# Altium project INCUBA 1.3.PrjPcb
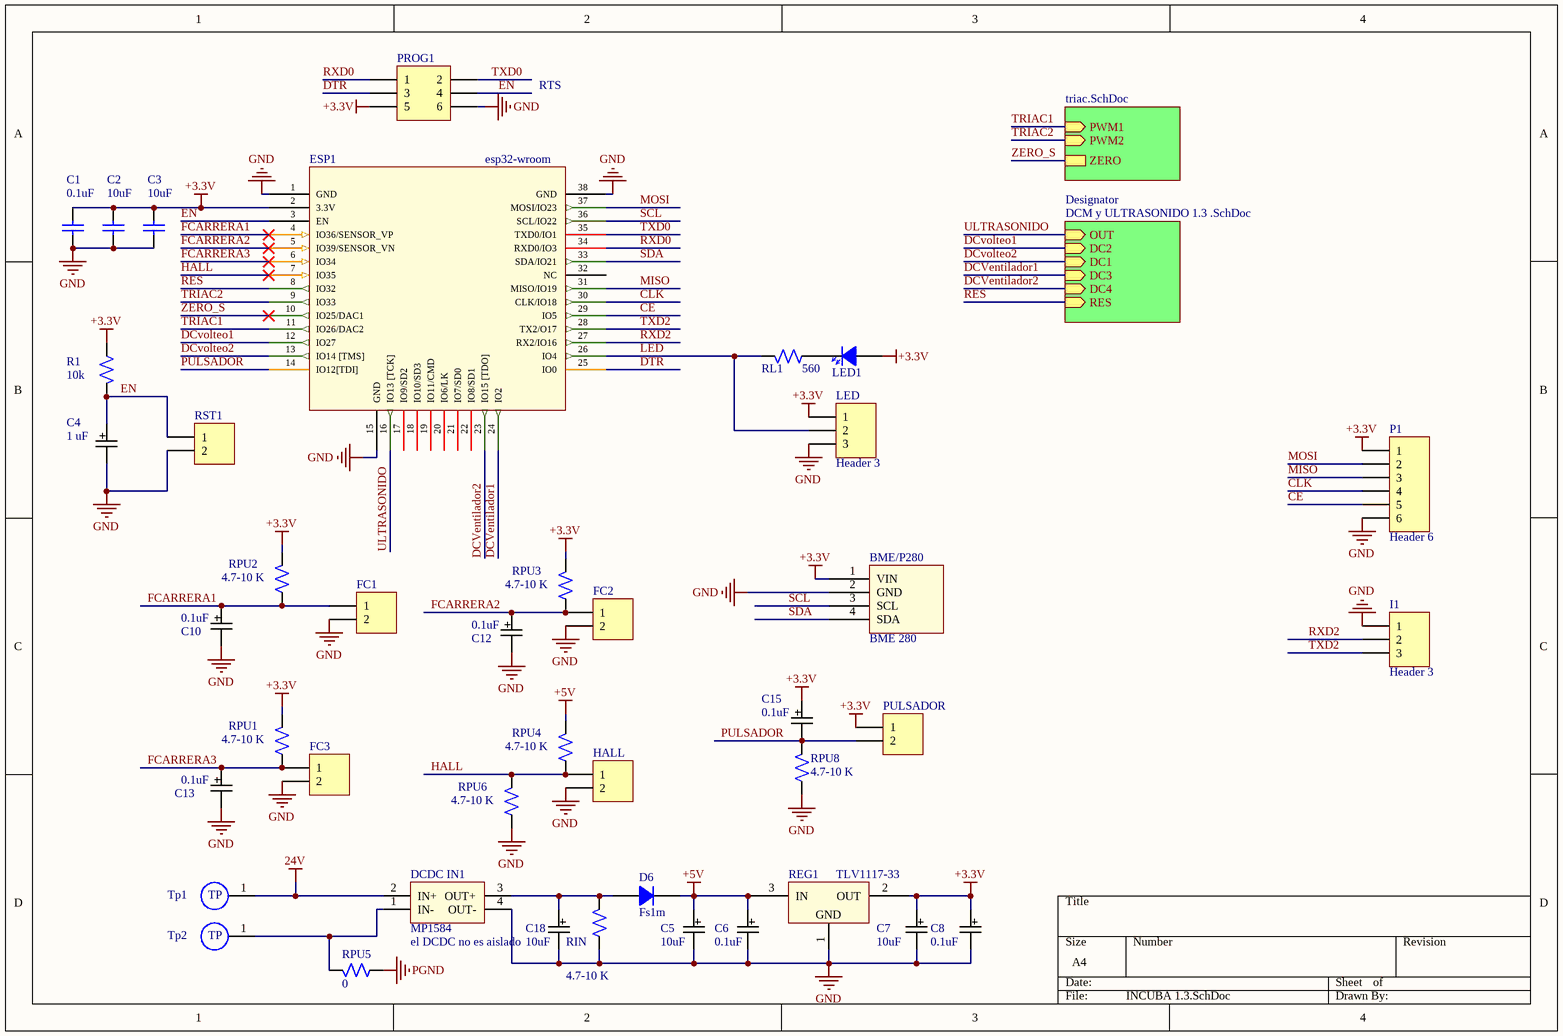
[diagram p0: INCUBA 1.3.SchDoc]
3 sheets, 83 parts. Net scope: hierarchical (ports join the sheet entries above them; power ports are global).
Board file: INCUBA 1.3.PcbDoc
Sheets:
  INCUBA 1.3.SchDoc
    Designator = triac.SchDoc
    Designator = DCM y ULTRASONIDO 1.3 .SchDoc

## Sheet INCUBA 1.3.SchDoc
size A4; SheetNumber: 1; SheetTotal: 3

### Parts
BME/P280  BME 280  [bme280]
C1  value 0.1uF  [0805]
C2  value 10uF  [0805]
C3  value 10uF  [0805]
C4  value 1 uF  [0805]  (hidden comment: Capacitor)
C5  value 10uF  [0805]  (hidden comment: Capacitor)
C6  value 0.1uF  [0805]  (hidden comment: Capacitor)
C7  value 10uF  [0805]  (hidden comment: Capacitor)
C8  0.1uF  [0805]
C10  value 0.1uF  [0805]  (hidden comment: Capacitor)
C12  value 0.1uF  [0805]  (hidden comment: Capacitor)
C13  value 0.1uF  [0805]  (hidden comment: Capacitor)
C15  value 0.1uF  [0805]  (hidden comment: Capacitor)
C18  value 10uF  [0805]  (hidden comment: Capacitor)
D6  Fs1m  [DO-214AC]
DCDC_IN1  MP1584  [MP1584]
ESP1  esp32-wroom  [esp32-wroom - modificado - sinpad]
FC1  Header 2  [HDR1X2]  (value not drawn)
FC2  Header 2  [HDR1X2]  (value not drawn)
FC3  Header 2  [HDR1X2]  (value not drawn)
HALL  Header 2  [HDR1X2]  (value not drawn)
I1  Header 3  [HDR1X3]
LED  Header 3  [HDR1X3]
LED1  LED_SMD  [0805 - led]  (value not drawn)
P1  Header 6  [HDR1X6]
PROG1  Header 3X2  [HDR2X3]  (value not drawn)
PULSADOR  Header 2  [HDR1X2]  (value not drawn)
R1  value 10k  [0805]  (hidden comment: Resistencia)
REG1  TLV1117-33  [SOT-223-4]
RIN  value 4.7-10 K  [0805]  (hidden comment: Resistencia)
RL1  value 560  [0805]  (hidden comment: Resistencia)
RPU1  value 4.7-10 K  [0805]  (hidden comment: Resistencia)
RPU2  value 4.7-10 K  [0805]  (hidden comment: Resistencia)
RPU3  value 4.7-10 K  [0805]  (hidden comment: Resistencia)
RPU4  value 4.7-10 K  [0805]  (hidden comment: Resistencia)
RPU5  value 0  [0805]  (hidden comment: Resistencia)
RPU6  value 4.7-10 K  [0805]  (hidden comment: Resistencia)
RPU8  value 4.7-10 K  [0805]  (hidden comment: Resistencia)
RST1  Header 2  [HDR1X2]  (value not drawn)
Tp1  Testpoint  [Testpoint]  (value not drawn)
Tp2  Testpoint  [Testpoint]  (value not drawn)

### Sub-sheets
Designator = triac.SchDoc: PWM1 (in), PWM2 (in), ZERO
Designator = DCM y ULTRASONIDO 1.3 .SchDoc: OUT (in), DC2 (in), DC1 (in), DC3 (in), DC4 (in), RES (in)

### Nets
24V: DCDC_IN1.2(IN+) Tp1.1(TP)
+3.3V: BME/P280.1(VIN) C1.2 C2.2 C3.2 C7.2 C8.2 C15.2 ESP1.2(3.3V) LED.1 LED1.2(A) P1.1 PROG1.5 PULSADOR.1 R1.2 REG1.2(OUT) RPU1.2 RPU2.2 RPU3.2
+5V: C5.2 C6.2 D6.1(K) REG1.3(IN) RPU4.2
GND: BME/P280.2(GND) C1.1 C2.1 C3.1 C4.1 C5.1 C6.1 C7.1 C8.1 C10.1 C12.1 C13.1 C18.1 DCDC_IN1.4(OUT-) ESP1.1(GND) ESP1.15(GND) ESP1.38(GND) FC1.2 FC2.2 FC3.2 HALL.2 I1.1 LED.3 P1.6 PROG1.6 REG1.1(GND) RIN.1 RPU6.1 RPU8.1 RST1.2
PGND: RPU5.1
CE: ESP1.29(IO5) P1.5
CLK: ESP1.30(CLK/IO18) P1.4
DCVentilador1: ESP1.24(IO2) ; sheet Designator/DC3
DCVentilador2: ESP1.23(IO15_[TDO]) ; sheet Designator/DC4
DCvolteo1: ESP1.12(IO27) ; sheet Designator/DC2
DCvolteo2: ESP1.13(IO14_[TMS]) ; sheet Designator/DC1
DTR: ESP1.25(IO0) PROG1.3
EN: C4.2 ESP1.3(EN) PROG1.4 R1.1 RST1.1
FCARRERA1: C10.2 ESP1.4(IO36/SENSOR_VP) FC1.1 RPU2.1
FCARRERA2: C12.2 ESP1.5(IO39/SENSOR_VN) FC2.1 RPU3.1
FCARRERA3: C13.2 ESP1.6(IO34) FC3.1 RPU1.1
HALL: ESP1.7(IO35) HALL.1 RPU4.1 RPU6.2
LED: ESP1.26(IO4) LED.2 RL1.2
MISO: ESP1.31(MISO/IO19) P1.3
MOSI: ESP1.37(MOSI/IO23) P1.2
PULSADOR: C15.1 ESP1.14(IO12[TDI]) PULSADOR.2 RPU8.2
RES: ESP1.8(IO32) ; sheet Designator/RES
RXD0: ESP1.34(RXD0/IO3) PROG1.1
RXD2: ESP1.27(RX2/IO16) I1.2
SCL: BME/P280.3(SCL) ESP1.36(SCL/IO22)
SDA: BME/P280.4(SDA) ESP1.33(SDA/IO21)
TRIAC1: ESP1.11(IO26/DAC2) ; sheet Designator/PWM1
TRIAC2: ESP1.9(IO33) ; sheet Designator/PWM2
TXD0: ESP1.35(TXD0/IO1) PROG1.2
TXD2: ESP1.28(TX2/O17) I1.3
ULTRASONIDO: ESP1.16(IO13_[TCK]) ; sheet Designator/OUT
ZERO_S: ESP1.10(IO25/DAC1) ; sheet Designator/ZERO
NetC18_2: C18.2 D6.2(A) DCDC_IN1.3(OUT+) RIN.2
NetDCDC_IN1_1: DCDC_IN1.1(IN-) RPU5.2 Tp2.1(TP)
NetLED1_1: LED1.1(K) RL1.1

Not connected (* = marked no-connect by the designer): ESP1 17(IO9/SD2) 18(IO10/SD3) 19(IO11/CMD) 20(IO6/LK) 21(IO7/SD0) 22(IO8/SD1) 32(NC)

### Notes on the sheet
- RTS
- el DCDC no es aislado

### Library data of the parts
C1-C3 = Cap SMD: Capacitor; Published: 8-Jun-2000; LatestRevisionDate: 29-May-2009; LatestRevisionNote: IPC-7351 Footprint Added.; PackageReference: C0805; Publisher: Altium Limited; PackageDescription: Chip Capacitor
C7 = Capacitor: 100UFX6.3V 10%. B=3528 (1210) TAN.SMD AVX Codigo Elemon CA3388050
C8 = Capacitor
D6 = Diodo: DSK14 , US1M. Fs1m; Published: 8-Jun-2000; LatestRevisionDate: 17-Jul-2002; LatestRevisionNote: Re-released for DXP Platform.; PackageDocument: Sep-1996; PackageReference: SMC; Publisher: Altium Limited; Code_JEDEC: DO-214-AB
FC1-FC3 HALL PULSADOR RST1 = Header 2: Header, 2-Pin; LatestRevisionDate: 17-Jul-2002; LatestRevisionNote: Re-released for DXP Platform.; Publisher: Altium Limited
I1 LED = Header 3: Header, 3-Pin; LatestRevisionDate: 17-Jul-2002; LatestRevisionNote: Re-released for DXP Platform.; Publisher: Altium Limited
LED1 = LED_SMD: Luminic signal diode; Published: 8-Jun-2000; LatestRevisionDate: 17-Jul-2002; LatestRevisionNote: Re-released for DXP Platform.; PackageDocument: Sep-1996; PackageReference: SMC; Publisher: Altium Limited; Code_JEDEC: DO-214-AB
P1 = Header 6: Header, 6-Pin; LatestRevisionDate: 17-Jul-2002; LatestRevisionNote: Re-released for DXP Platform.; Publisher: Altium Limited
PROG1 = Header 3X2: Header, 3-Pin, Dual row; System: Connector; LatestRevisionDate: 17-Jul-2002; LatestRevisionNote: Re-released for DXP Platform.; Publisher: Altium Limited
R1 RIN RL1 RPU1-RPU6 RPU8 = Resistencia: Resistencia  de con varios Footprint
Tp1 Tp2 = Testpoint: Tespoint

## Sheet triac.SchDoc
size A4; SheetNumber: 2; SheetTotal: 3
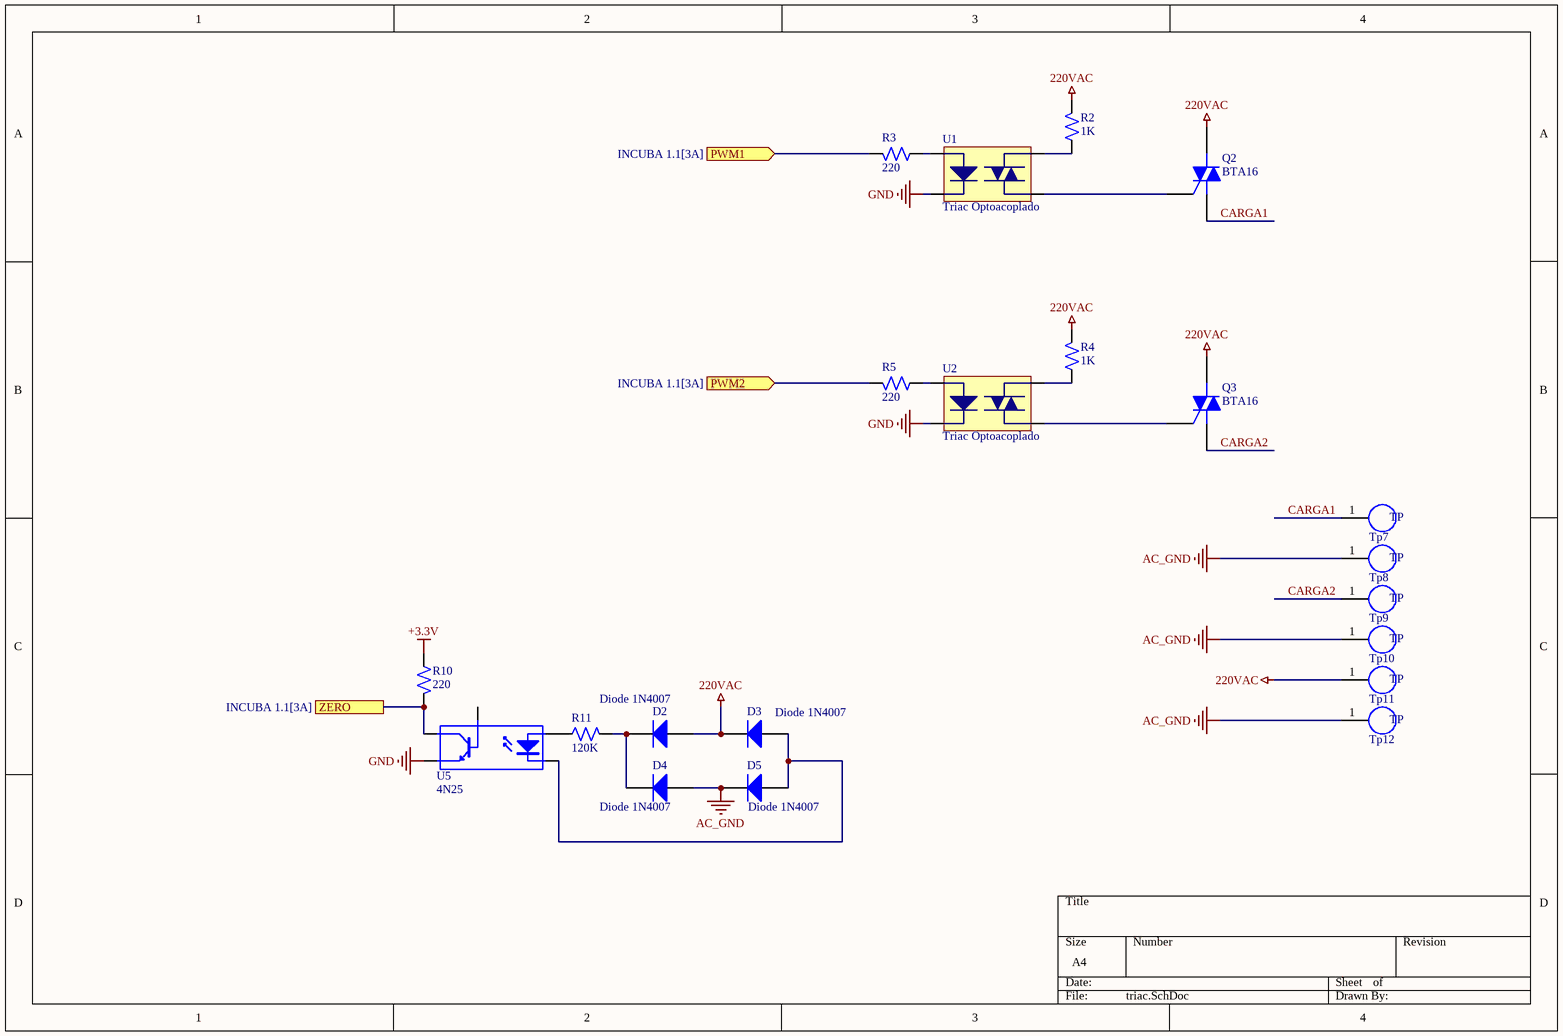
[diagram p1: triac.SchDoc]

### Parts
D2  Diode 1N4007  [DO-214AC]
D3  Diode 1N4007  [DO-214AC]
D4  Diode 1N4007  [DO-214AC]
D5  Diode 1N4007  [DO-214AC]
Q2  BTA16  [TO-220]
Q3  BTA16  [TO-220]
R2  value 1K  [0805]  (hidden comment: Resistencia)
R3  value 220  [0805]  (hidden comment: Resistencia)
R4  value 1K  [0805]  (hidden comment: Resistencia)
R5  value 220  [0805]  (hidden comment: Resistencia)
R10  value 220  [0805]  (hidden comment: Resistencia)
R11  value 120K  [0805]  (hidden comment: Resistencia)
Tp7  Testpoint  [Testpoint]  (value not drawn)
Tp8  Testpoint  [Testpoint]  (value not drawn)
Tp9  Testpoint  [Testpoint]  (value not drawn)
Tp10  Testpoint  [Testpoint]  (value not drawn)
Tp11  Testpoint  [Testpoint]  (value not drawn)
Tp12  Testpoint  [Testpoint]  (value not drawn)
U1  Triac Optoacoplado  [DIP6]
U2  Triac Optoacoplado  [DIP6]
U5  4N25  [DIP6]

### Ports
PWM1 (in, see INCUBA 1.1[3A]), PWM2 (in, see INCUBA 1.1[3A]), ZERO (see INCUBA 1.1[3A])

### Nets
220VAC: D2.1(A) D3.2(K) Q2.2(M2) Q3.2(M2) R2.2 R4.2 Tp11.1(TP)
+3.3V: R10.1
AC_GND: D4.1(A) D5.2(K) Tp8.1(TP) Tp10.1(TP) Tp12.1(TP)
GND: U1.2 U2.2 U5.4(E)
CARGA1: Q2.1(M1) Tp7.1(TP)
CARGA2: Q3.1(M1) Tp9.1(TP)
TRIAC1: R3.2 ; port PWM1
TRIAC2: R5.2 ; port PWM2
ZERO_S: R10.2 U5.5(C) ; port ZERO
NetD2_2: D2.2(K) D4.2(K) R11.2
NetD3_1: D3.1(A) D5.1(A) U5.2(K)
NetQ2_3: Q2.3(G) U1.4
NetQ3_3: Q3.3(G) U2.4
NetR2_1: R2.1 U1.6
NetR3_1: R3.1 U1.1
NetR4_1: R4.1 U2.6
NetR5_1: R5.1 U2.1
NetR11_1: R11.1 U5.1(A)

Not connected (* = marked no-connect by the designer): U5 6(B)

### Library data of the parts
D2-D5 = Diode 1N4007: 1 Amp General Purpose Rectifier; Published: 8-Jun-2000; LatestRevisionDate: 17-Jul-2002; LatestRevisionNote: Re-released for DXP Platform.; DatasheetVersion: 1998; PackageVersion: Aug-1999; PackageReference: DO-41; Publisher: Altium Limited; PackageDescription: Diode, Axial; Body 5.2 x 2.7 mm (LxDia. max), Lead Dia. 0.86 mm (max); Code_JEDEC: DO-204-AL; ComponentLink1Description: Manufacturer Link; ComponentLink1URL: http://www.fairchildsemi.com/; ComponentLink2Description: Datasheet; ComponentLink2URL: http://www.fairchildsemi.com/ds/1N%2F1N4001.pdf
Q2 Q3 = BTA41600B: Triac (40 Amps 600V)
R2-R5 R10 R11 = Resistencia: Resistencia  de con varios Footprint
Tp7-Tp12 = Testpoint: Tespoint
U1 U2 = MOC3040
U5 = 4N25: 5 Pin Mini Flat Pack Optocoupler; Published: 24-Mar-1999; LatestRevisionDate: 04-Mar-2005; LatestRevisionNote: PCB Footprint replaced, Sch pins re-numbered.; DatasheetVersion: Apr-2004; PackageReference: SOP5(6); Publisher: Altium Limited; PackageDescription: Small Outline; 6 Leads (1 Absent); Body Width 4.4 mm; Pitch 1.27 mm

## Sheet DCM y ULTRASONIDO 1.3 .SchDoc
size A4; SheetNumber: 3; SheetTotal: 3
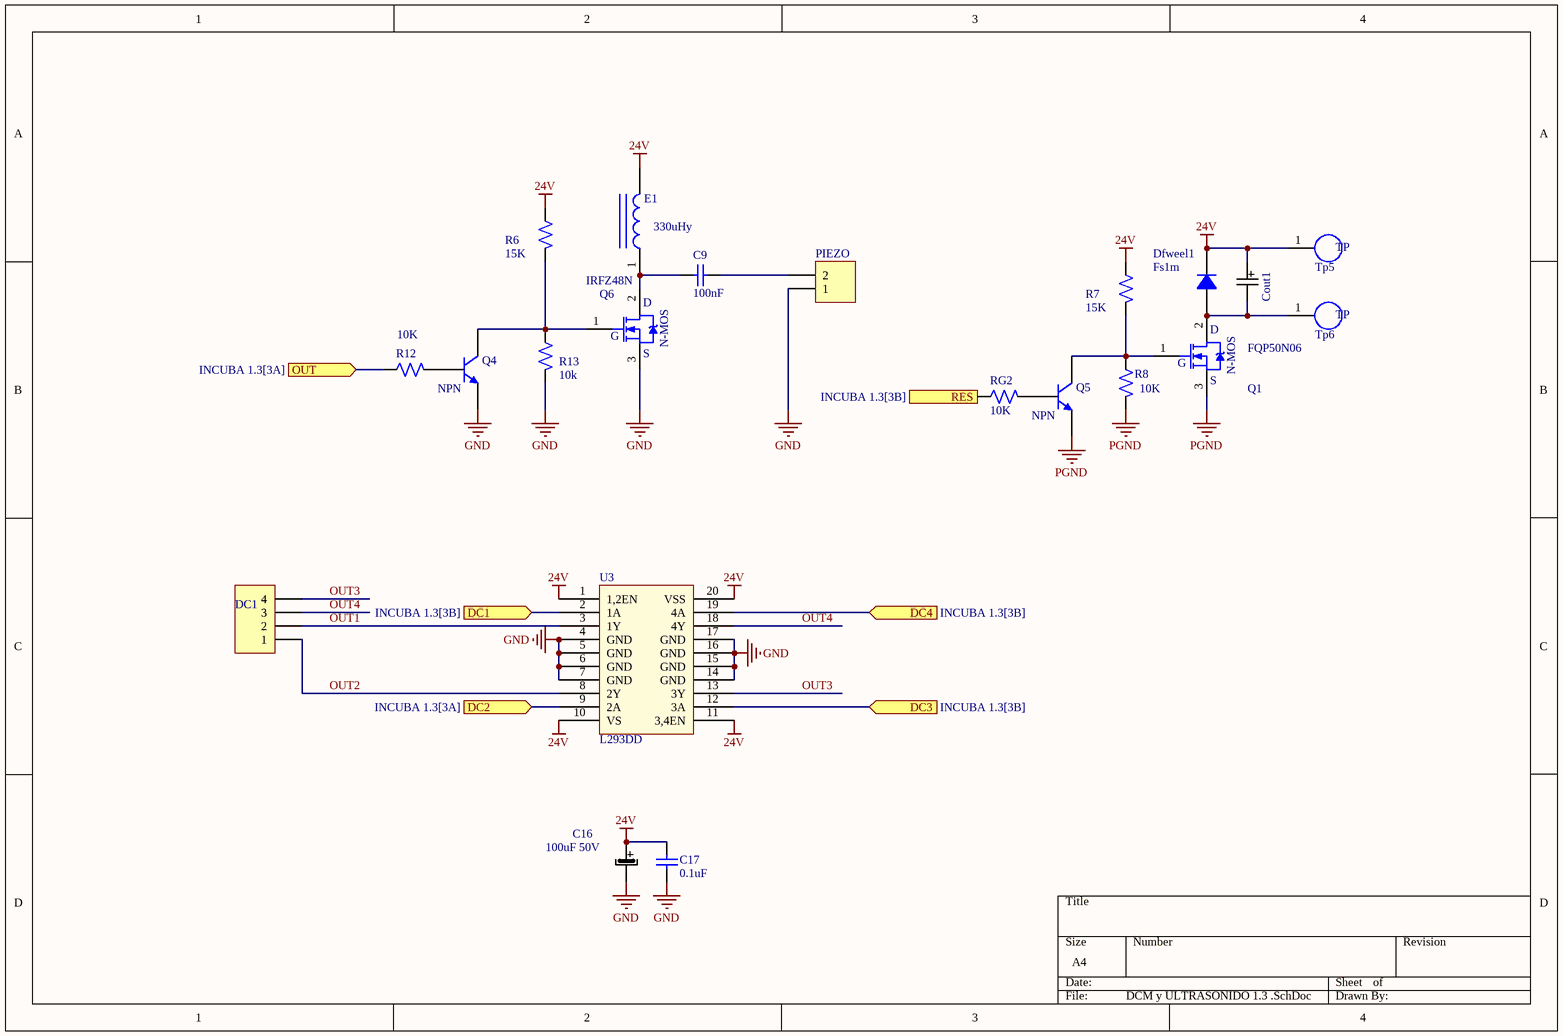
[diagram p2: DCM y ULTRASONIDO 1.3 .SchDoc]

### Parts
C9  value 100nF  [0805]
C16  value 100uF 50V  [cap100]  (hidden comment: Capacitor)
C17  value 0.1uF  [0805]
Cout1  Cout  [0805]  (value not drawn)
DC1  Header 4  [HDR1X4]  (value not drawn)
Dfweel1  Fs1m  [DO-214AC]
E1  value 330uHy  [res200]  (hidden comment: Inductor Iron)
PIEZO  Header 2  [HDR1X2]  (value not drawn)
Q1  FQP50N06  [TO-220]
Q4  NPN  [SOT23-5_hall]
Q5  NPN  [SOT23-5_hall]
Q6  IRFZ48N  [TO-220]
R6  value 15K  [0805]  (hidden comment: Resistencia)
R7  value 15K  [0805]  (hidden comment: Resistencia)
R8  value 10K  [0805]  (hidden comment: Resistencia)
R12  value 10K  [0805]  (hidden comment: Resistencia)
R13  value 10k  [0805]  (hidden comment: Resistencia)
RG2  value 10K  [0805]  (hidden comment: RG)
Tp5  Testpoint  [Testpoint]  (value not drawn)
Tp6  Testpoint  [Testpoint]  (value not drawn)
U3  L293DD  [SOIC127P1032X265-20N]

### Ports
DC1 (in, see INCUBA 1.3[3B]), DC2 (in, see INCUBA 1.3[3A]), DC3 (in, see INCUBA 1.3[3B]), DC4 (in, see INCUBA 1.3[3B]), OUT (in, see INCUBA 1.3[3A]), RES (in, see INCUBA 1.3[3B])

### Nets
24V: C16.2 C17.1 Cout1.2 Dfweel1.1(K) E1.2 R6.2 R7.2 Tp5.1(TP) U3.1(1,2EN) U3.10(VS) U3.11(3,4EN) U3.20(VSS)
GND: C16.1 C17.2 PIEZO.1 Q4.2(E) Q6.3(S) R13.1 U3.4(GND) U3.5(GND) U3.6(GND) U3.7(GND) U3.14(GND) U3.15(GND) U3.16(GND) U3.17(GND)
PGND: Q1.3(S) Q5.2(E) R8.1
DCVentilador1: U3.12(3A) ; port DC3
DCVentilador2: U3.19(4A) ; port DC4
DCvolteo1: U3.9(2A) ; port DC2
DCvolteo2: U3.2(1A) ; port DC1
OUT1: DC1.2 U3.3(1Y)
OUT2: DC1.1 U3.8(2Y)
OUT3: DC1.4 U3.13(3Y)
OUT4: DC1.3 U3.18(4Y)
RES: RG2.1 ; port RES
ULTRASONIDO: R12.2 ; port OUT
NetC9_1: C9.1 E1.1 Q6.2(D)
NetC9_2: C9.2 PIEZO.2
NetCout1_1: Cout1.1 Dfweel1.2(A) Q1.2(D) Tp6.1(TP)
NetQ1_1: Q1.1(G) Q5.3(C) R7.1 R8.2
NetQ4_1: Q4.1(B) R12.1
NetQ4_3: Q4.3(C) Q6.1(G) R6.1 R13.2
NetQ5_1: Q5.1(B) RG2.2

### Notes on the sheet
- (in symbol IRFZ48N) N-MOS

### Library data of the parts
C9 C17 = Cap SMD: Capacitor; Published: 8-Jun-2000; LatestRevisionDate: 29-May-2009; LatestRevisionNote: IPC-7351 Footprint Added.; PackageReference: C0805; Publisher: Altium Limited; PackageDescription: Chip Capacitor
C16 = Capacitor_Polarizado: Capacitor Polarizado
Cout1 = Capacitor
DC1 = Header 4: Header, 4-Pin; LatestRevisionDate: 17-Jul-2002; LatestRevisionNote: Re-released for DXP Platform.; Publisher: Altium Limited
Dfweel1 = Diodo: DSK14 , US1M. Fs1m; Published: 8-Jun-2000; LatestRevisionDate: 17-Jul-2002; LatestRevisionNote: Re-released for DXP Platform.; PackageDocument: Sep-1996; PackageReference: SMC; Publisher: Altium Limited; Code_JEDEC: DO-214-AB
E1 = Inductor Iron: Magnetic-Core Inductor; Published: 24-Mar-1999; LatestRevisionDate: 17-Jul-2002; LatestRevisionNote: Re-released for DXP Platform.; PackageReference: AXIAL-0.9; Publisher: Altium Limited
PIEZO = Header 2: Header, 2-Pin; LatestRevisionDate: 17-Jul-2002; LatestRevisionNote: Re-released for DXP Platform.; Publisher: Altium Limited
Q1 Q6 = IRFZ48N: IRLZ44; Note: Pin 2 is electrically connected to pin 4.; Published: 8-Jun-2000; LatestRevisionDate: 17-Jul-2002; LatestRevisionNote: Re-released for DXP Platform.; DatasheetVersion: PD-9.814; PackageVersion: Feb-1997; PackageReference: TO-220AB; Publisher: Altium Limited; PackageDescription: TO, Thru-Hole, Vertical, Heatsink Mounted; 3 In-Line Leads; Pitch 2.54 mm; ComponentLink1Description: Manufacturer Link; ComponentLink1URL: http://www.irf.com/
Q4 Q5 = GMBT2222A
R6-R8 R12 R13 RG2 = Resistencia: Resistencia  de con varios Footprint
Tp5 Tp6 = Testpoint: Tespoint

## Nets that join several sheets
24V: INCUBA 1.3 (DCDC_IN1.2 Tp1.1), DCM y ULTRASONIDO 1.3  (12 pins)
+3.3V: INCUBA 1.3 (18 pins), triac (R10.1)
GND: INCUBA 1.3 (30 pins), triac (U1.2 U2.2 U5.4), DCM y ULTRASONIDO 1.3  (14 pins)
PGND: INCUBA 1.3 (RPU5.1), DCM y ULTRASONIDO 1.3  (Q1.3 Q5.2 R8.1)
DCVentilador1: INCUBA 1.3 (ESP1.24), DCM y ULTRASONIDO 1.3  (U3.12)
DCVentilador2: INCUBA 1.3 (ESP1.23), DCM y ULTRASONIDO 1.3  (U3.19)
DCvolteo1: INCUBA 1.3 (ESP1.12), DCM y ULTRASONIDO 1.3  (U3.9)
DCvolteo2: INCUBA 1.3 (ESP1.13), DCM y ULTRASONIDO 1.3  (U3.2)
RES: INCUBA 1.3 (ESP1.8), DCM y ULTRASONIDO 1.3  (RG2.1)
TRIAC1: INCUBA 1.3 (ESP1.11), triac (R3.2)
TRIAC2: INCUBA 1.3 (ESP1.9), triac (R5.2)
ULTRASONIDO: INCUBA 1.3 (ESP1.16), DCM y ULTRASONIDO 1.3  (R12.2)
ZERO_S: INCUBA 1.3 (ESP1.10), triac (R10.2 U5.5)